# EAGLE schematic IVSense (EAGLE 6.1)
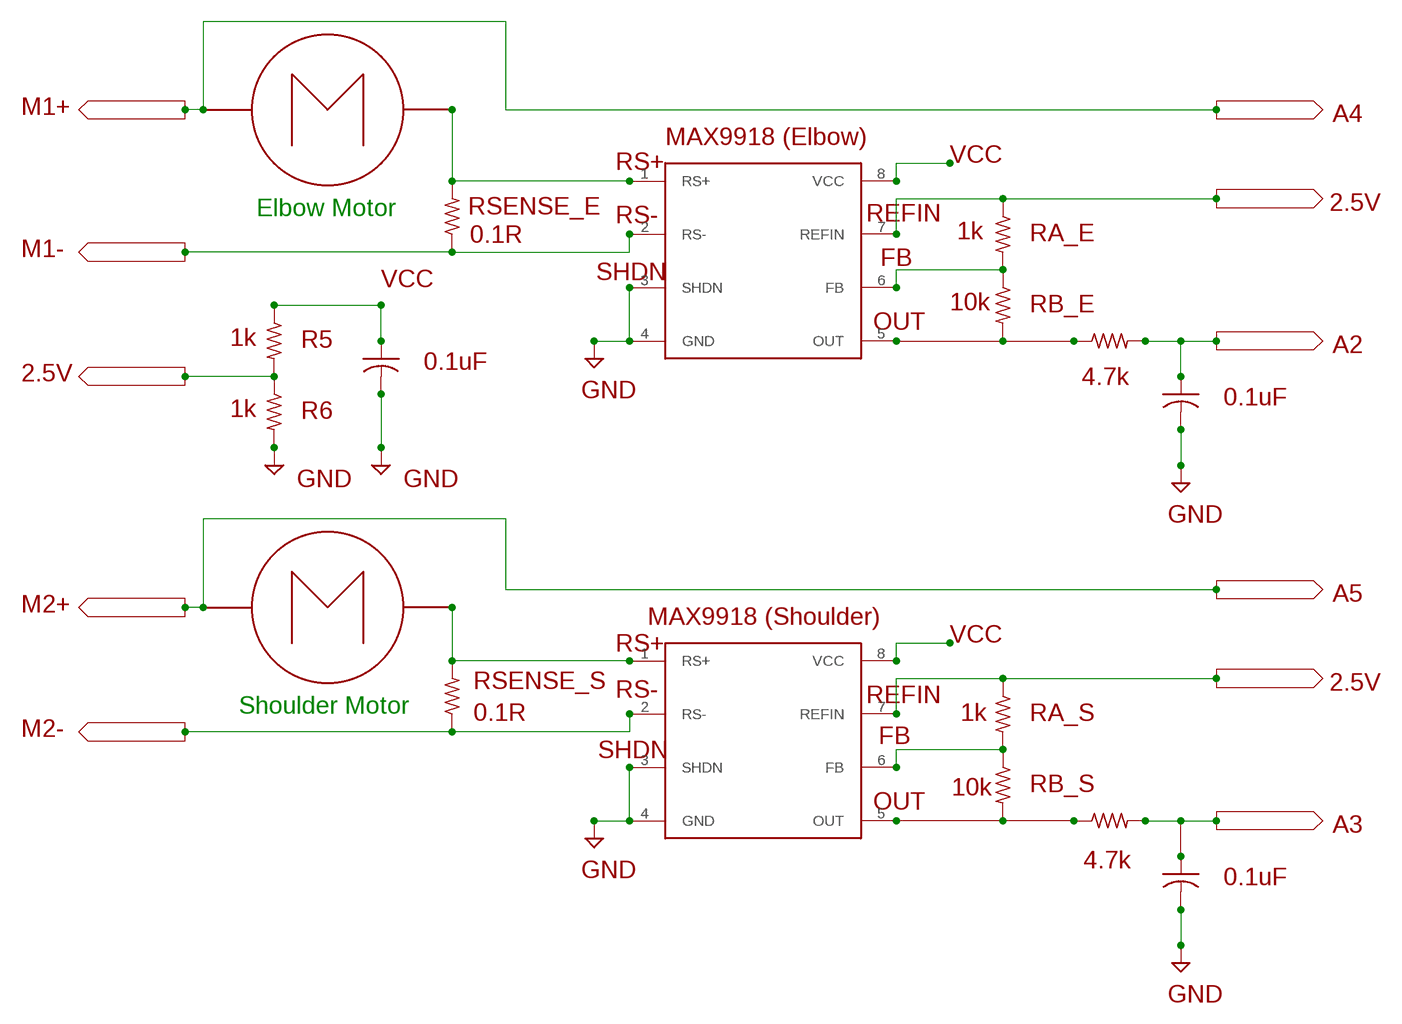
[diagram p0: schematic, sheet 1]

## Parts
C1  0.1uF  C-US025-025X050  [C025-025X050]
C2  0.1uF  C-US025-025X050  [C025-025X050]
C3  0.1uF  C-US025-025X050  [C025-025X050]
MAX9918_ELBOW  MAX9918 (Elbow)  MAX9918  [SO08]
MAX9918_SHOULDER  MAX9918 (Shoulder)  MAX9918  [SO08]
R5  1k  R-US_0204/5  [0204/5]
R6  1k  R-US_0204/5  [0204/5]
RA_E  1k  R-US_0204/5  [0204/5]
RA_S  1k  R-US_0204/5  [0204/5]
RB_E  10k  R-US_0204/5  [0204/5]
RB_S  10k  R-US_0204/5  [0204/5]
RF_E  4.7k  R-US_0204/5  [0204/5]
RF_S  4.7k  R-US_0204/5  [0204/5]
RSENSE_E  0.1R  R-US_0204/5  [0204/5]
RSENSE_S  0.1R  R-US_0204/5  [0204/5]
U$4  MOTOR_GENERIC  [MOTOR_PACKAGE]
U$5  MOTOR_GENERIC  [MOTOR_PACKAGE]

## Nets
2.5V: R5.2 R6.1
A2: C3.1 RF_E.2
A3: C2.1 RF_S.2
GND: C1.2 C2.2 C3.2 MAX9918_ELBOW.4(GND) MAX9918_SHOULDER.4(GND) R6.2
M1+: U$4.P$1(IN)
M1-: MAX9918_ELBOW.2(RS-) RSENSE_E.1
M2+: U$5.P$1(IN)
M2-: MAX9918_SHOULDER.2(RS-) RSENSE_S.1
N$1: MAX9918_ELBOW.6(FB) RA_E.2 RB_E.1
N$2: MAX9918_SHOULDER.6(FB) RA_S.2 RB_S.1
N$3: MAX9918_ELBOW.1(RS+) RSENSE_E.2 U$4.P$2(OUT)
N$5: MAX9918_SHOULDER.7(REFIN) RA_S.1
N$6: MAX9918_SHOULDER.1(RS+) RSENSE_S.2 U$5.P$2(OUT)
N$8: MAX9918_ELBOW.7(REFIN) RA_E.1
N$9: RF_S.1
N$10: RF_E.1
N$13: RB_E.2
N$14: MAX9918_ELBOW.5(OUT)
N$15: RB_S.2
N$16: MAX9918_SHOULDER.5(OUT)
VCC: C1.1 MAX9918_ELBOW.8(VCC) MAX9918_SHOULDER.8(VCC) R5.1
Unconnected: MAX9918_ELBOW.3(SHDN) MAX9918_SHOULDER.3(SHDN)

## Notes on the sheet
- MAX9918 (Elbow)
- RS+
- Elbow Motor | REFIN
- RS-
- FB
- SHDN
- OUT
- MAX9918 (Shoulder)
- RS+
- RS- | REFIN
- Shoulder Motor
- FB
- SHDN
- OUT

## Library data of the parts
C1-C3 = adafruit:C-US: CAPACITOR, American symbol
MAX9918_ELBOW MAX9918_SHOULDER = CAP:MAX9918: Maxim MAX9918 -20V to +75V Input Range, Precision Uni-/Bidirectional, Current-Sense Amplifiers
R5 R6 RA_E RA_S RB_E RB_S RF_E RF_S RSENSE_E RSENSE_S = resistor:R-US_: RESISTOR, American symbol
U$4 U$5 = CAP:MOTOR_GENERIC: it's just a goddamn motor symbol, leave me alone